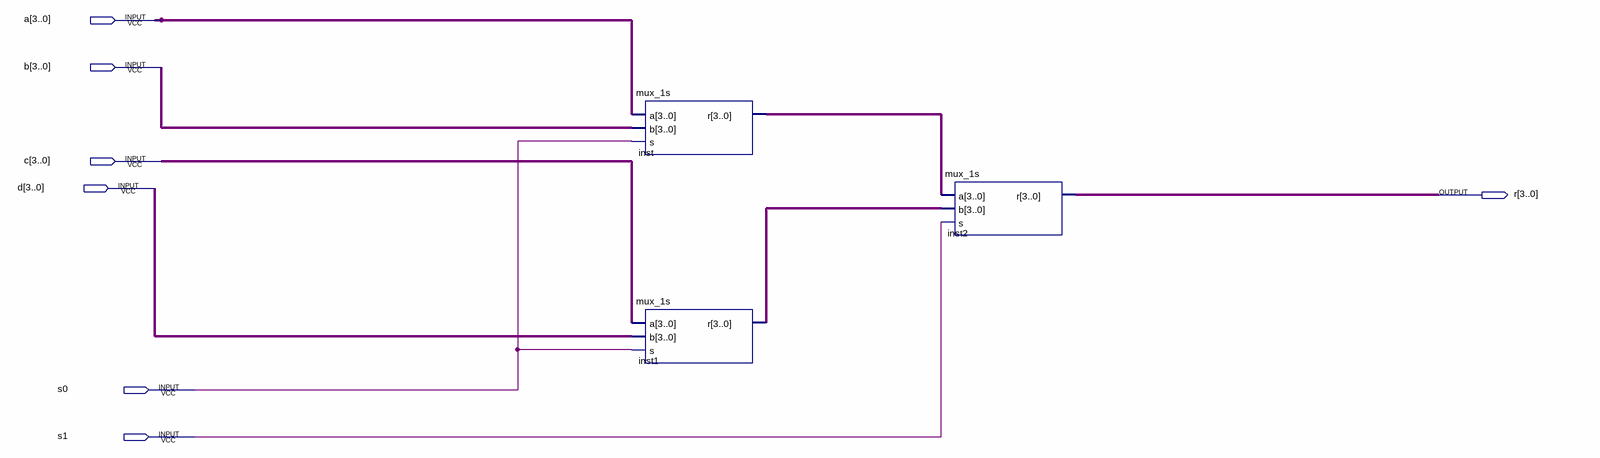
[diagram p0: schematic sheet]
// Quartus schematic mux4_2.bdf as structural Verilog: 3 symbols, 7 pins
module mux4_2 (
  input  [3:0] a,
  input  [3:0] b,
  input  [3:0] c,
  input  [3:0] d,
  input  s0,
  input  s1,
  output [3:0] r
);

  wire [3:0] inst1_r, inst_r;

  mux_1s inst (.a(a), .b(b), .s(s0), .r(inst_r));
  mux_1s inst1 (.a(c), .b(d), .s(s0), .r(inst1_r));
  mux_1s inst2 (.a(inst_r), .b(inst1_r), .s(s1), .r(r));
endmodule
